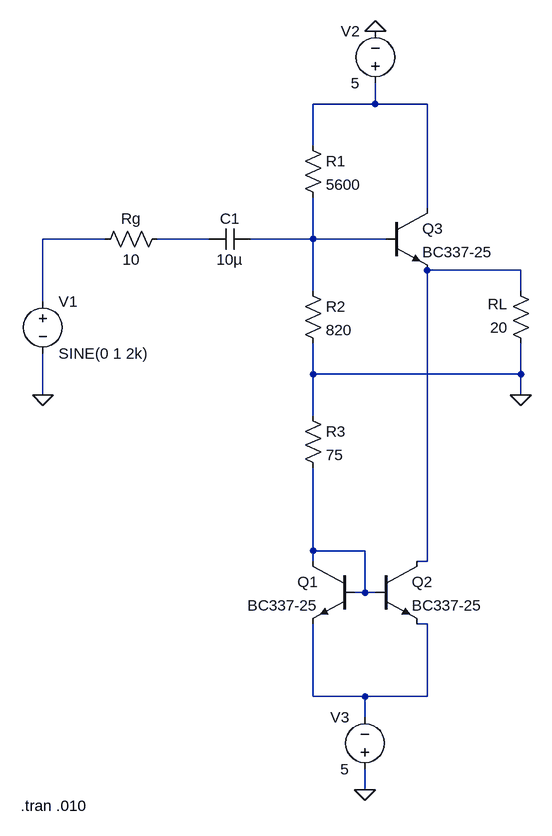
[diagram p0: schematic Problema 2 TP2.asc]
Problema 2 TP2.asc, the LTspice schematic file:
Version 4
SHEET 1 900 808
WIRE 576 -288 576 -320
WIRE 576 -288 480 -288
WIRE 656 -288 576 -288
WIRE 480 -224 480 -288
WIRE 656 -128 656 -288
WIRE 160 -80 64 -80
WIRE 320 -80 240 -80
WIRE 480 -80 480 -144
WIRE 480 -80 384 -80
WIRE 592 -80 480 -80
WIRE 800 -32 656 -32
WIRE 480 0 480 -80
WIRE 800 0 800 -32
WIRE 64 16 64 -80
WIRE 480 128 480 80
WIRE 800 128 800 80
WIRE 800 128 480 128
WIRE 64 160 64 96
WIRE 800 160 800 128
WIRE 480 192 480 128
WIRE 480 400 480 272
WIRE 560 400 480 400
WIRE 480 416 480 400
WIRE 656 416 656 -32
WIRE 656 416 640 416
WIRE 560 464 560 400
WIRE 560 464 544 464
WIRE 576 464 560 464
WIRE 656 512 640 512
WIRE 480 624 480 512
WIRE 560 624 480 624
WIRE 656 624 656 512
WIRE 656 624 560 624
WIRE 560 656 560 624
WIRE 560 768 560 736
FLAG 800 160 0
FLAG 64 160 0
FLAG 576 -400 0
FLAG 560 768 0
SYMBOL voltage 64 0 R0
WINDOW 123 0 0 Left 0
WINDOW 39 0 0 Left 0
SYMATTR InstName V1
SYMATTR Value SINE(0 1 2k)
SYMBOL res 464 -240 R0
SYMATTR InstName R1
SYMATTR Value 5600
SYMBOL res 464 -16 R0
SYMATTR InstName R2
SYMATTR Value 820
SYMBOL res 464 176 R0
SYMATTR InstName R3
SYMATTR Value 75
SYMBOL res 256 -96 R90
WINDOW 0 0 56 VBottom 2
WINDOW 3 32 56 VTop 2
SYMATTR InstName Rg
SYMATTR Value 10
SYMBOL res 816 96 R180
WINDOW 0 36 76 Left 2
WINDOW 3 36 40 Left 2
SYMATTR InstName RL
SYMATTR Value 20
SYMBOL npn 544 416 M0
SYMATTR InstName Q1
SYMATTR Value BC337-25
SYMBOL npn 576 416 R0
SYMATTR InstName Q2
SYMATTR Value BC337-25
SYMBOL npn 592 -128 R0
SYMATTR InstName Q3
SYMATTR Value BC337-25
SYMBOL cap 384 -96 R90
WINDOW 0 0 32 VBottom 2
WINDOW 3 32 32 VTop 2
SYMATTR InstName C1
SYMATTR Value 10µ
SYMBOL voltage 576 -304 R180
WINDOW 0 24 96 Left 2
WINDOW 3 24 16 Left 2
SYMATTR InstName V2
SYMATTR Value 5
SYMBOL voltage 560 752 R180
WINDOW 0 24 96 Left 2
WINDOW 3 24 16 Left 2
SYMATTR InstName V3
SYMATTR Value 5
TEXT 30 792 Left 2 !.tran .010

The netlist it stands for:
* Problema 2 TP2.asc
V1 N002 0 SINE(0 1 2k)
R1 N001 N004 5600
R2 N004 0 820
R3 0 N006 75
Rg N003 N002 10
RL 0 N005 20
Q1 N006 N006 N007 0 BC337-25
Q2 N005 N006 N007 0 BC337-25
Q3 N001 N004 N005 0 BC337-25
C1 N004 N003 10µ
V2 N001 0 5
V3 0 N007 5
.model NPN NPN
.model PNP PNP
.lib standard.bjt
.tran .010
.backanno
.end